# Altium schematic sheet Power.SchDoc
size A4; DocumentNumber: 11; SheetNumber: 11; SheetTotal: 12
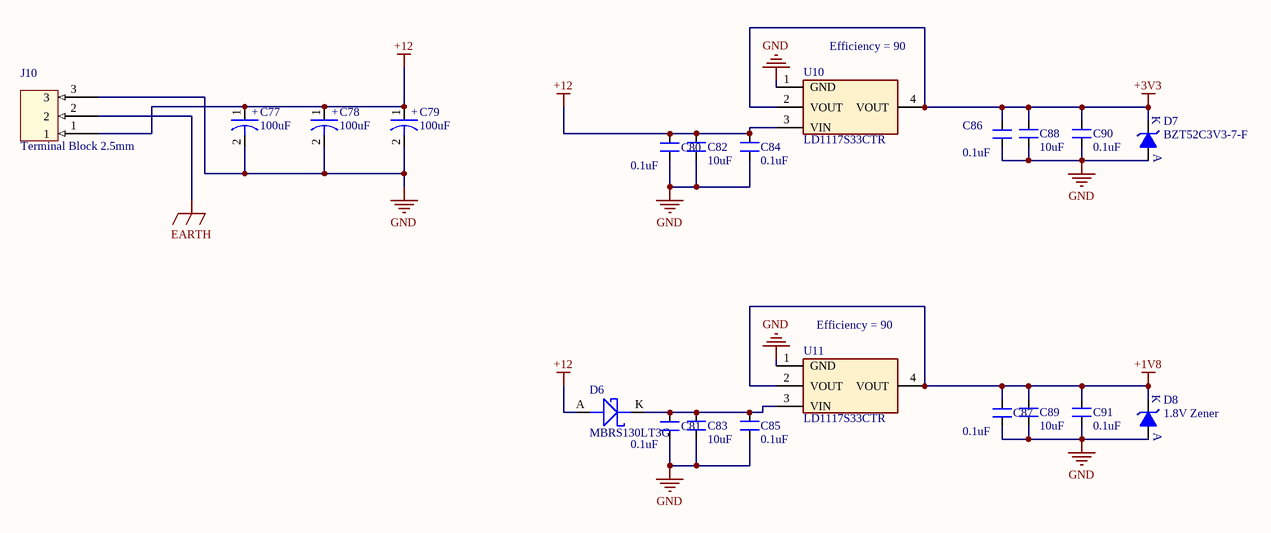
[diagram p0: Power.SchDoc]

## Parts
C77  100uF  [ACAP_P305_D393_H393_RAD]
C78  100uF  [ACAP_P305_D393_H393_RAD]
C79  100uF  [ACAP_P305_D393_H393_RAD]
C80  0.1uF  [CAP_0805]
C81  0.1uF  [CAP_0805]
C82  10uF  [CAP_1206]
C83  10uF  [CAP_1206]
C84  0.1uF  [CAP_0805]
C85  0.1uF  [CAP_0805]
C86  0.1uF  [CAP_0805]
C87  0.1uF  [CAP_0805]
C88  10uF  [CAP_1206]
C89  10uF  [CAP_1206]
C90  0.1uF  [CAP_0805]
C91  0.1uF  [CAP_0805]
D6  MBRS130LT3G  [DIO_SMB_DO-214AA]
D7  BZT52C3V3-7-F  [DIO_SOD-123]
D8  1.8V Zener  [DIO_DO-213AB_SMD]
J10  Terminal Block 2.5mm  [CON3_100_TB_TH_ST]
U10  LD1117S33CTR  [SOT223_3]
U11  LD1117S33CTR  [SOT223_3]

## Nets
+1V8: C87.2 C89.2 C91.2 D8.K U11.2(VOUT) U11.4(VOUT)
+3V3: C86.2 C88.2 C90.2 D7.K U10.2(VOUT) U10.4(VOUT)
+12: C77.1 C78.1 C79.1 C80.2 C82.2 C84.2 D6.A J10.1 U10.3(VIN)
EARTH: J10.2
GND: C77.2 C78.2 C79.2 C80.1 C81.1 C82.1 C83.1 C84.1 C85.1 C86.1 C87.1 C88.1 C89.1 C90.1 C91.1 D7.A D8.A J10.3 U10.1(GND) U11.1(GND)
NetC81_2: C81.2 C83.2 C85.2 D6.K U11.3(VIN)

## Notes on the sheet
- (near U10) Efficiency = 90
- (near U11) Efficiency = 90
- (in symbol CAP-P_100uF-50V-20%-RAD) +

## Library data of the parts
C77-C79 = CAP-P_100uF-50V-20%-RAD: 100µF 50V Aluminum Polymer Capacitor Radial, Can - SMD 28mOhm 4000 Hrs @ 125°C; Manufacturer: Nichicon; Manufacturer Part Number: GYA1H101MCQ1GS; Alternate Part Number-1: VEU101M1HTR-1010; Case/Package: Radial-SMD; Supplier-1: SP ROAD; Supplier Part Number-1: GYA1H101MCQ1GS
C80 C81 C86 C87 = CAP_0.1uF-50V-20%-0805: 0.1µF ±20% 50V Ceramic Capacitor X7R 0805 (2012 Metric); Manufacturer: Samsung Electro-Mechanics; Manufacturer Part Number: CL21B104MBCNNNC; Alternate Part Number-1: NA; Case/Package: 0805; Supplier-1: SIRICOM; Supplier Part Number-1: 0805B104K500CT
C82 C83 C88 C89 = CAP_10uF-50V-10%-1206: 10µF ±10% 50V Ceramic Capacitor X7R 1206 (3216 Metric); Manufacturer: KEMET; Manufacturer Part Number: CL31B106KBHNNNE; Alternate Part Number-1: GRT31CR61H106ME01L; Case/Package: 1206; Supplier-1: SIRICOM; Supplier Part Number-1: CC1206KKX5R9BB106
C84 C85 C90 C91 = CAP_0.1uF-50V-10%-0805: 0.1µF ±10% 50V Ceramic Capacitor X7R 0805 (2012 Metric); Manufacturer: Samsung; Manufacturer Part Number: CL21B104KBCNNNC; Alternate Part Number-1: NA; Case/Package: 0805; Supplier-1: SIRICOM; Supplier Part Number-1: 0805B104K500CT
D6 = DIO-S_445mV-30V-2A-SMB: Diode Schottky 30V 2A Surface Mount SMB; Manufacturer: ON Semiconductor; Alternate Part Number-1: NA; Manufacturer Part Number: MBRS130LT3G; Case/Package: SMB; Supplier-1: ARROW; Supplier Part Number-1: MBRS130LT3G
D7 = DIO-Z_3.3V-500mW-SOD123: Zener Diode 3.3V 500mW ±6% Surface Mount SOD-123; Manufacturer: Diodes Incorporated; Alternate Part Number-1: NA; Manufacturer Part Number: BZT52C3V3-7-F; Case/Package: SOD-123; Supplier-1: Digikey; Supplier Part Number-1: BZT52C3V3-FDICT-ND
D8 = DIO-Z_1.8V-500mW-DO213AA: Zener Diode 1.8V 500mW ±5% Surface Mount DO-213AA; Manufacturer: *; Manufacturer Part Number: *; Case/Package: *; Supplier-1: *; Supplier Part Number-1: *; Alternate Part Number-1: *
J10 = CON-TB_3X1-100-ST-TH: 3 Pins, 1 Row 2.54mm Pitch, straight Connector, male; Manufacturer Part Number: 1725669; Manufacturer: Phoenix Contact; Alternate Part Number-1: NA; Case/Package: TH-CON; Supplier-1: SP ROAD; Supplier Part Number-1: 1725669
U10 U11 = REG_15V-3.3V-0.9A-12W-SOT223: Linear Voltage Regulator IC 1 Output 800mA SOT-223; Manufacturer: STMicroelectronics; Alternate Part Number-1: NA; Manufacturer Part Number: LD1117S33CTR; Case/Package: SOT223; Supplier-1: SP ROAD; Supplier Part Number-1: LD1117S33CTR